# Altium schematic sheet SCH_LICH_VAN_NIEN.SchDoc
size A; SheetNumber: 1; SheetTotal: 1
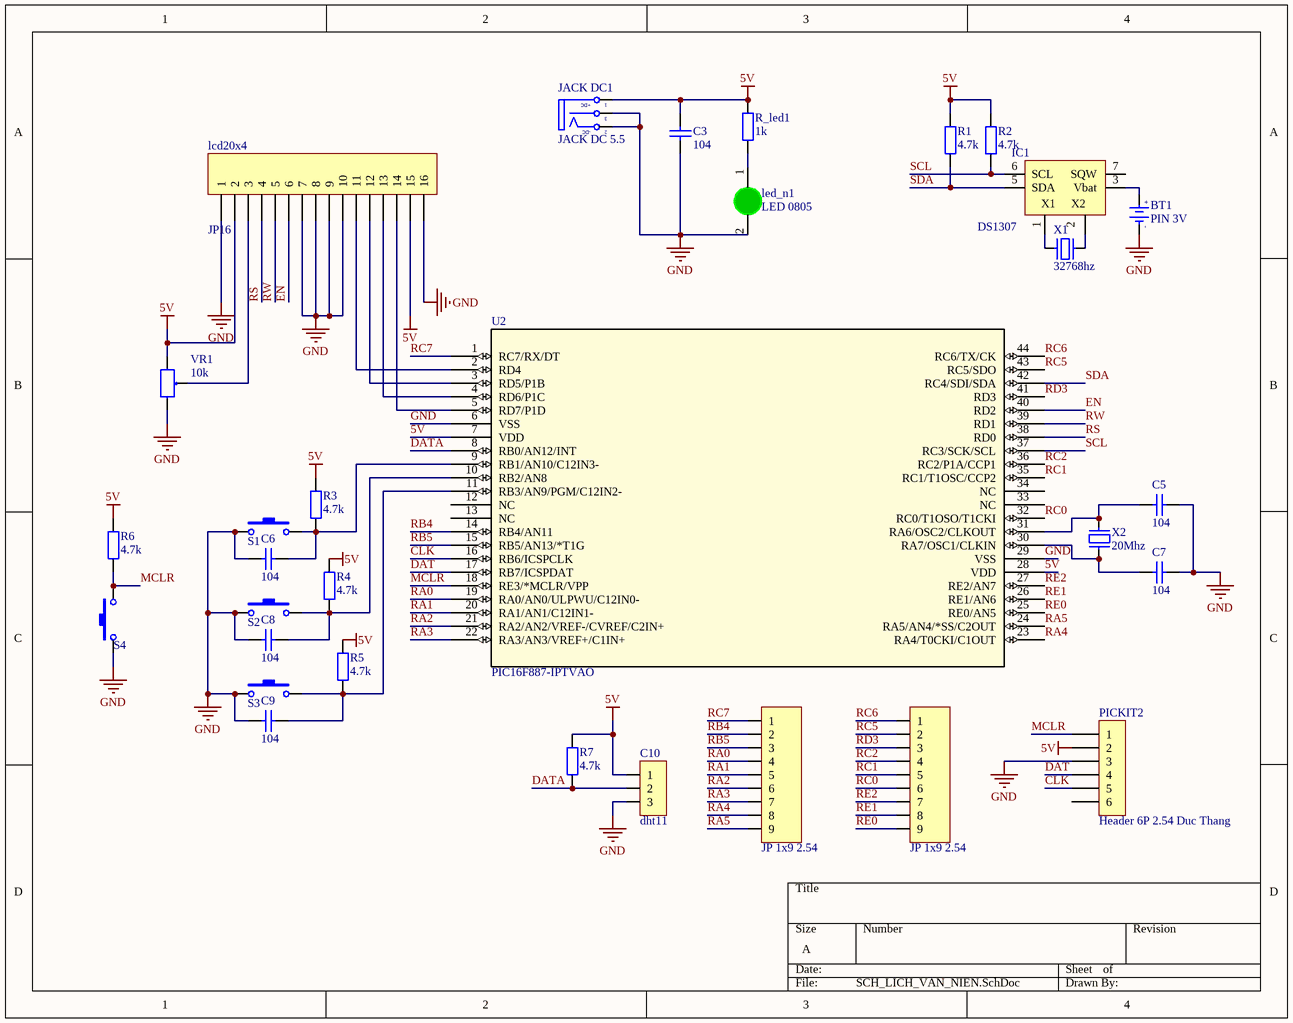
[diagram p0: SCH_LICH_VAN_NIEN.SchDoc]

## Parts
BT1  PIN 3V  [PIN3V]
C3  104  [tu 0805]
C5  104  [tu 0805]
C6  104  [tu 0805]
C7  104  [tu 0805]
C8  104  [tu 0805]
C9  104  [tu 0805]
C10  dht11  [JP3-C1T]
IC1  DS1307  [DIP8]
JACK_DC1  JACK DC 5.5  [JACK DC 5.5]
JP1  JP 1x9 2.54  [JP 1x9 CT]
JP2  JP 1x9 2.54  [JP 1x9 CT]
lcd20x4  JP16  [JP16-D1T]
led_n1  LED 0805  [LED-1206-Green]
PICKIT2  Header 6P 2.54 Duc Thang  [XH2.54M-6]
R1  4.7k  [tro smd 0805]
R2  4.7k  [tro smd 0805]
R3  4.7k  [tro smd 0805]
R4  4.7k  [tro smd 0805]
R5  4.7k  [tro smd 0805]
R6  4.7k  [tro smd 0805]
R7  4.7k  [tro smd 0805]
R_led1  1k  [tro smd 0805]
S1  SW  [BUTTON-SMD 2PIN]  (value not drawn)
S2  SW  [BUTTON-SMD 2PIN]  (value not drawn)
S3  SW  [BUTTON-SMD 2PIN]  (value not drawn)
S4  SW  [BUTTON-SMD 2PIN]  (value not drawn)
U2  PIC16F887-IPTVAO  [TQFP44_PT_MCH]
VR1  10k  [VR-S2]
X1  32768hz  [XT2-32.768KHz-2_V]
X2  20Mhz  [XTAL-RU49/4]

## Nets
5V: C3.1 C10.1 JACK_DC1.1(T) lcd20x4.2 lcd20x4.15 PICKIT2.2 R1.2 R2.2 R3.2 R4.2 R5.2 R6.2 R7.2 R_led1.2 U2.7(VDD) U2.28(VDD) VR1.1
GND: BT1.2(GND) C3.2 C5.1 C6.2 C7.1 C8.2 C9.2 C10.3 IC1.4(GND) JACK_DC1.2(TN) JACK_DC1.3(S) lcd20x4.1 lcd20x4.7 lcd20x4.8 lcd20x4.9 lcd20x4.10 lcd20x4.16 led_n1.2(K) PICKIT2.3 S1.1 S2.1 S3.1 S4.1 U2.6(VSS) U2.29(VSS) VR1.3
VCC: IC1.8(VCC)
CLK: PICKIT2.5 U2.16(RB6/ICSPCLK)
DAT: PICKIT2.4 U2.17(RB7/ICSPDAT)
DATA: C10.2 R7.1 U2.8(RB0/AN12/INT)
EN: lcd20x4.6 U2.40(RD2)
MCLR: PICKIT2.1 R6.1 S4.2 U2.18(RE3/*MCLR/VPP)
RA0: JP1.4 U2.19(RA0/AN0/ULPWU/C12IN0-)
RA1: JP1.5 U2.20(RA1/AN1/C12IN1-)
RA2: JP1.6 U2.21(RA2/AN2/VREF-/CVREF/C2IN+)
RA3: JP1.7 U2.22(RA3/AN3/VREF+/C1IN+)
RA4: JP1.8 U2.23(RA4/T0CKI/C1OUT)
RA5: JP1.9 U2.24(RA5/AN4/*SS/C2OUT)
RB4: JP1.2 U2.14(RB4/AN11)
RB5: JP1.3 U2.15(RB5/AN13/*T1G)
RC0: JP2.6 U2.32(RC0/T1OSO/T1CKI)
RC1: JP2.5 U2.35(RC1/T1OSC/CCP2)
RC2: JP2.4 U2.36(RC2/P1A/CCP1)
RC5: JP2.2 U2.43(RC5/SDO)
RC6: JP2.1 U2.44(RC6/TX/CK)
RC7: JP1.1 U2.1(RC7/RX/DT)
RD3: JP2.3 U2.41(RD3)
RE0: JP2.9 U2.25(RE0/AN5)
RE1: JP2.8 U2.26(RE1/AN6)
RE2: JP2.7 U2.27(RE2/AN7)
RS: lcd20x4.4 U2.38(RD0)
RW: lcd20x4.5 U2.39(RD1)
SCL: IC1.6(SCL) R2.1 U2.37(RC3/SCK/SCL)
SDA: IC1.5(SDA) R1.1 U2.42(RC4/SDI/SDA)
NetBT1_1: BT1.1(+3V) IC1.3(Vbat)
NetC5_2: C5.2 U2.31(RA6/OSC2/CLKOUT) X2.2
NetC6_1: C6.1 R3.1 S1.2 U2.9(RB1/AN10/C12IN3-)
NetC7_2: C7.2 U2.30(RA7/OSC1/CLKIN) X2.1
NetC8_1: C8.1 R4.1 S2.2 U2.10(RB2/AN8)
NetC9_1: C9.1 R5.1 S3.2 U2.11(RB3/AN9/PGM/C12IN2-)
NetIC1_1: IC1.1(X1) X1.1
NetIC1_2: IC1.2(X2) X1.2
Netlcd20x4_3: lcd20x4.3 VR1.2
Netlcd20x4_11: lcd20x4.11 U2.2(RD4)
Netlcd20x4_12: lcd20x4.12 U2.3(RD5/P1B)
Netlcd20x4_13: lcd20x4.13 U2.4(RD6/P1C)
Netlcd20x4_14: lcd20x4.14 U2.5(RD7/P1D)
Netled_n1_1: led_n1.1(A) R_led1.1

Not connected (* = marked no-connect by the designer): IC1 7(SQW); PICKIT2 6; U2 12(NC) 13(NC) 33(NC) 34(NC)

## Notes on the sheet
- (in symbol JACK DC 5.5) +DC; -DC
- (in symbol PIN 3V) +; -

## Library data of the parts
BT1 = PIN 3V: Battery 3VDC; Value: PIN 3V
C3 C5-C9 = Tu 0805 104 50V 10%: Dán; Don_Vi: Con; So_Chan: 2; Ten_Linh_Kien: Tụ 0805 104-100nF 10% 50V; Ma_Hang: MH004551; Chung_Loai: Dán; Kieu_Chan: *
C10 = JP3: WR-PHD 2.54 mm Angled Socket Header; Manufacturer: W¨¹rth Elektronik eiSos GmbH; partNo: 613003143121; ComponentLink1 Description: Manufacturer; ComponentLink2 Description: Datasheet; NoPins: 03; Created Date: 29 March 2013; ComponentLink1URL: http://www.we-online.com; ComponentLink2URL: http://katalog.we-online.de/em/datasheet/6130xx143121.pdf; Created by: Karrer Zheng
IC1 = DS1307: Real Timer Serial; Value: DS1307
JACK_DC1 = JACK DC 5.5: Value: Jac DC
JP1 JP2 = JP 1x9 2.54 Cai Thang: Cắm; Ten_Linh_Kien: Jump Đơn Cái 2.54MM 1x20P Thẳng; Don_Vi: Con; Ma_Hang: MH004006; Ghi_Chu: *; Kieu_Chan: *; Chung_Loai: Cắm
lcd20x4 = JP16: WR-PHD 2.54 mm Angled Socket Header; Manufacturer: W¨¹rth Elektronik eiSos GmbH; partNo: 613016143121; ComponentLink1 Description: Manufacturer; ComponentLink2 Description: Datasheet; NoPins: 16; Created Date: 29 March 2013; ComponentLink1URL: http://www.we-online.com; ComponentLink2URL: http://katalog.we-online.de/em/datasheet/6130xx143121.pdf; Created by: Karrer Zheng
led_n1 = LED 1206 Xanh La: Dán; Don_Vi: Con; Ma_Hang: MH002947; Ten_Linh_Kien: LED1206 Màu Xanh Lá (Green); Ghi_Chu: *; Kieu_Chan: *; Chung_Loai: Dán
PICKIT2 = Header 6P 2.54 Duc Thang: Cắm; Ten_Linh_Kien: Header 6P XH2.54-6P Đực Thẳng; Don_Vi: Con; Ma_Hang: MH001972; Chung_Loai: Cắm
R1-R7 R_led1 = Tro 0805 5% 4.7k: Dán; Don_Vi: Con; So_Chan: 2; Ten_Linh_Kien: Trở 0805 5% 4.7k; Ma_Hang: MH005307; Chung_Loai: Dán; Kieu_Chan: *
S1-S4 = SW-Button: Switch-Button; Published: 24-Mar-1999; LatestRevisionDate: 17-Jul-2002; LatestRevisionNote: Re-released for DXP Platform.; PackageReference: SPST-2; Publisher: Altium Limited
U2 = PIC16F887-IPTVAO: No Description Available; Mfr_Name: Microchip; RefDes: RefDes; Type: Type
VR1 = Resistor Var
X1 X2 = XT2: Crystal, 32.768 KHz, -40 to 85 degC, 3.2 x 1.5 x 0.9 mm SMD; Value: 4Mhz